# Altium schematic sheet MAZ000180 - Diagrama físico.SchDoc: MAZ000180 - Diagrama físico
size A; ApprovedBy: Christian Ledwidth; CheckedBy: Nahuel Martinez; Author: Santiago Marti; CompanyName: Body Health; DrawnBy: Santiago Marti; Revision: A; SheetNumber: 1; SheetTotal: 2
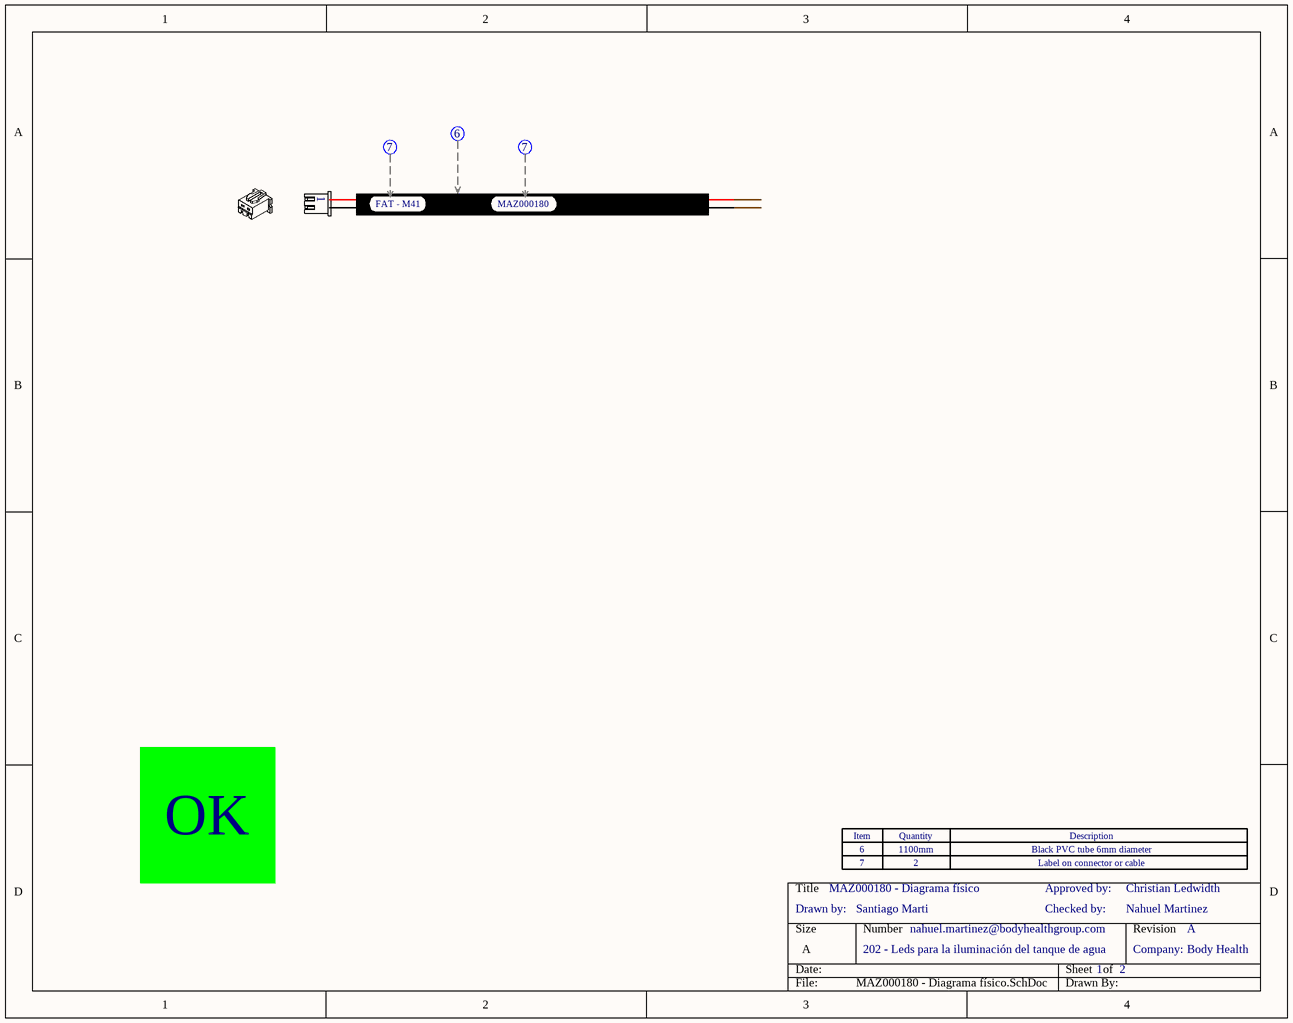
[diagram p0: MAZ000180 - Diagrama físico.SchDoc]

## Parts
(Parts that share a designator on the sheet are numbered #1, #2 ... from top to bottom, then left to right.)
Con?#1  XHP-2  (value not drawn)  (part C of 4)
Con?#2  XHP-2  (value not drawn)  (part C of 4)
Con?#3  XHP-2  (value not drawn)  (part C of 4)
Con?#4  XHP-2  (value not drawn)  (part A of 4)
Con?#5  XHP-2  (value not drawn)  (part B of 4)
Zoc?#1  Zócalo_Header  (value not drawn)
Zoc?#2  Zócalo_Item  (value not drawn)
Zoc?#3  Zócalo_Item  (value not drawn)

## Notes on the sheet
- (near Con?#2) FAT - M41
- (near Con?#3) MAZ000180
- OK
- (near Zoc?#3) Drawn by:
- (near Zoc?#3) 7
- (near Zoc?#1) 6
- 2
- 1100mm
- Checked by:
- Approved by:
- Label on connector or cable
- Black PVC tube 6mm diameter
- 202 - Leds para la iluminación del tanque de agua
- nahuel.martinez@bodyhealthgroup.com
- Company:
- (in symbol Zócalo_Header) Item; Quantity; Description

## Library data of the parts
Con?#1 = XHP-2: CONN HOUSING 2.5MM 2POS; Fabricante: JST Sales America Inc.; CallOut: 6; Cod.DigiKey: 455-2266-ND; Cod.Fabricante: XHP-2; ComponentLink1Description: Manufacturer Link; ComponentLink1URL: http://www.jst-mfg.com/product/pdf/eng/eXH.pdf; DIGIKEYx50: 0.05620; DIGIKEYx100: NO
Con?#2 Con?#3 = XHP-2: CONN HOUSING 2.5MM 2POS; Fabricante: JST Sales America Inc.; CallOut: 7; Cod.DigiKey: 455-2266-ND; Cod.Fabricante: XHP-2; ComponentLink1Description: Manufacturer Link; ComponentLink1URL: http://www.jst-mfg.com/product/pdf/eng/eXH.pdf; DIGIKEYx50: 0.05620; DIGIKEYx100: NO
Con?#4 Con?#5 = XHP-2: CONN HOUSING 2.5MM 2POS; Fabricante: JST Sales America Inc.; Cod.DigiKey: 455-2266-ND; Cod.Fabricante: XHP-2; ComponentLink1Description: Manufacturer Link; ComponentLink1URL: http://www.jst-mfg.com/product/pdf/eng/eXH.pdf; DIGIKEYx50: 0.05620; CallOut: *; DIGIKEYx100: NO
Zoc?#1 = Zócalo_Header: Header para el zócalo de referencias
Zoc?#2 Zoc?#3 = Zócalo_Item: Ítem para el zócalo de referencias; Desginator: *; Quantity: *; ItemDescription: *